# EAGLE design like-a-g35 (EAGLE 6.2)
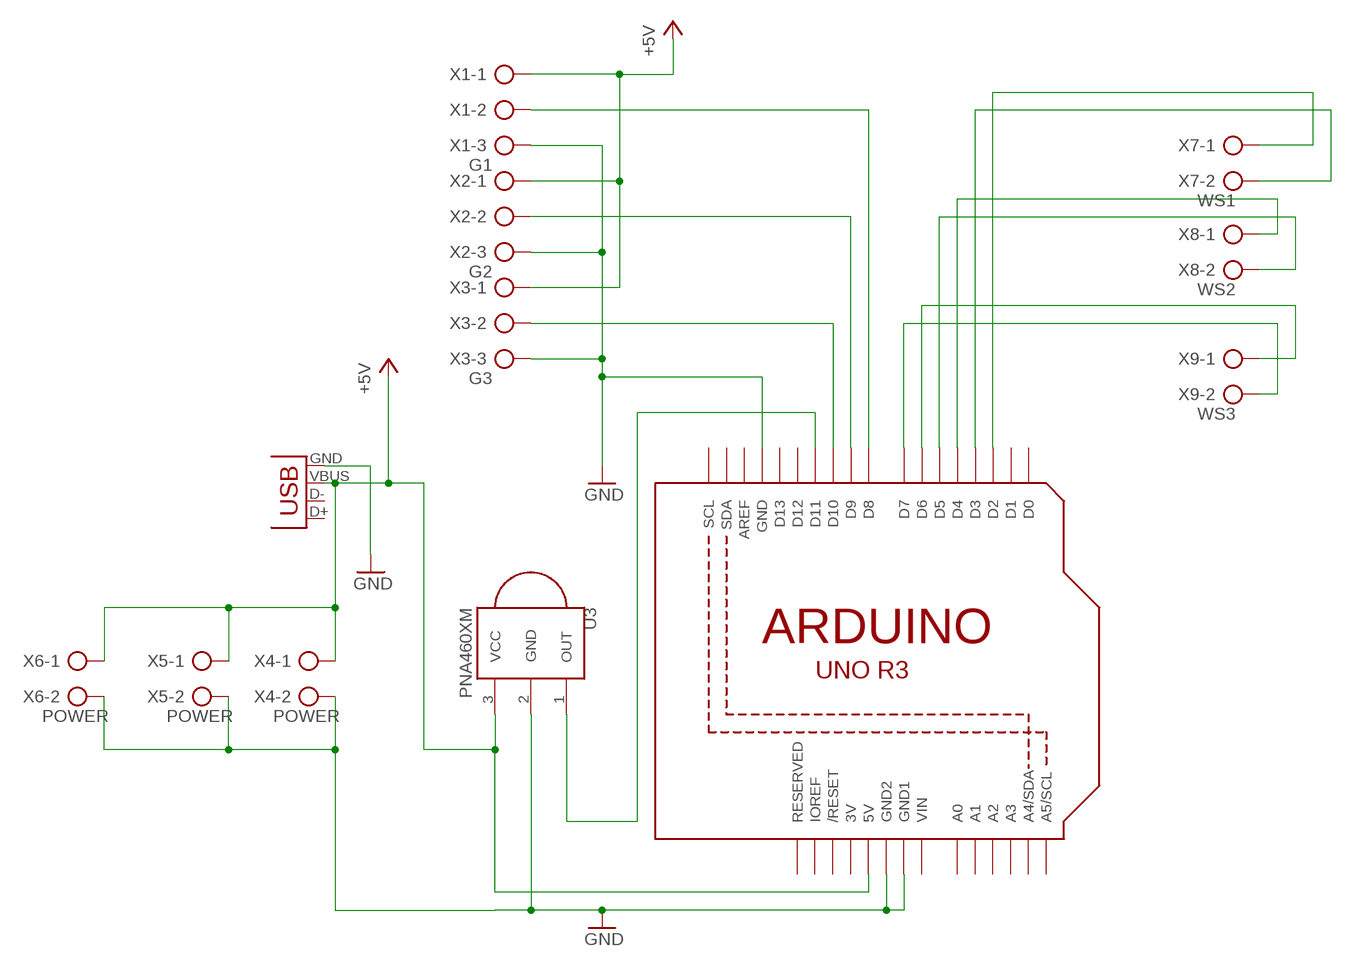
[diagram p0: schematic, sheet 1]

## Parts
U1  ARDUINOR3-DIMENSION  [ARDUINOR3]
U2  FCI_8193_MICRO_USB  [FCI_MICRO_USB_8193]
U3  PNA460XM  [PNA460XM]
X1  G1  AK300/3  [AK300/3]
X2  G2  AK300/3  [AK300/3]
X3  G3  AK300/3  [AK300/3]
X4  POWER  AK300/2  [AK300/2]
X5  POWER  AK300/2  [AK300/2]
X6  POWER  AK300/2  [AK300/2]
X7  WS1  AK300/2  [AK300/2]
X8  WS2  AK300/2  [AK300/2]
X9  WS3  AK300/2  [AK300/2]

## Nets
+5V: U1.5V U2.VBUS U3.3(VCC) X1.1 X2.1 X3.1 X4.1 X5.1 X6.1
CLK1: U1.D3 X7.2
CLK2: U1.D5 X8.2
CLK3: U1.D7 X9.2
DATA1: U1.D2 X7.1
DATA2: U1.D4 X8.1
DATA3: U1.D6 X9.1
GDATA1: U1.D8 X1.2
GDATA2: U1.D9 X2.2
GDATA3: U1.D10 X3.2
GND: U1.GND U1.GND1 U1.GND2 U2.GND U3.2(GND) X1.3 X2.3 X3.3 X4.2 X5.2 X6.2
IR-OUT: U1.D11 U3.1(OUT)
Unconnected: U1.A0 U1.A1 U1.A2 U1.A3 U1.A4(A4/SDA) U1.A5(A5/SCL) U1.AREF U1.D0 U1.D1 U1.D12 U1.D13 U1.IOREF U1.RESERVED U1.RESET(/RESET) U1.SCL U1.SDA U2.D+ U2.D-

## Power pins joined to a net without a drawn wire
3V: U1.3V
VIN: U1.VIN

## Library data of the parts
U1 = adafruit:ARDUINOR3: This is a new object for the new Arduino R3 - with extra pins that you may want to use (such as IOref, and duplicated A4/A5
U2 = programmer:FCI_8193_MICRO_USB
U3 = adafruit:PNA460XM: IR 38KHz receiver PNA4602 and related receivers http://www.ladyada.net/library/pcb/eaglelibrary.html
X1-X3 = like-a-g35:AK300/3: CONNECTOR; OC_FARNELL: unknown; OC_NEWARK: unknown
X4-X9 = con-ptr500:AK300/2: CONNECTOR; OC_FARNELL: unknown; OC_NEWARK: unknown

## Board
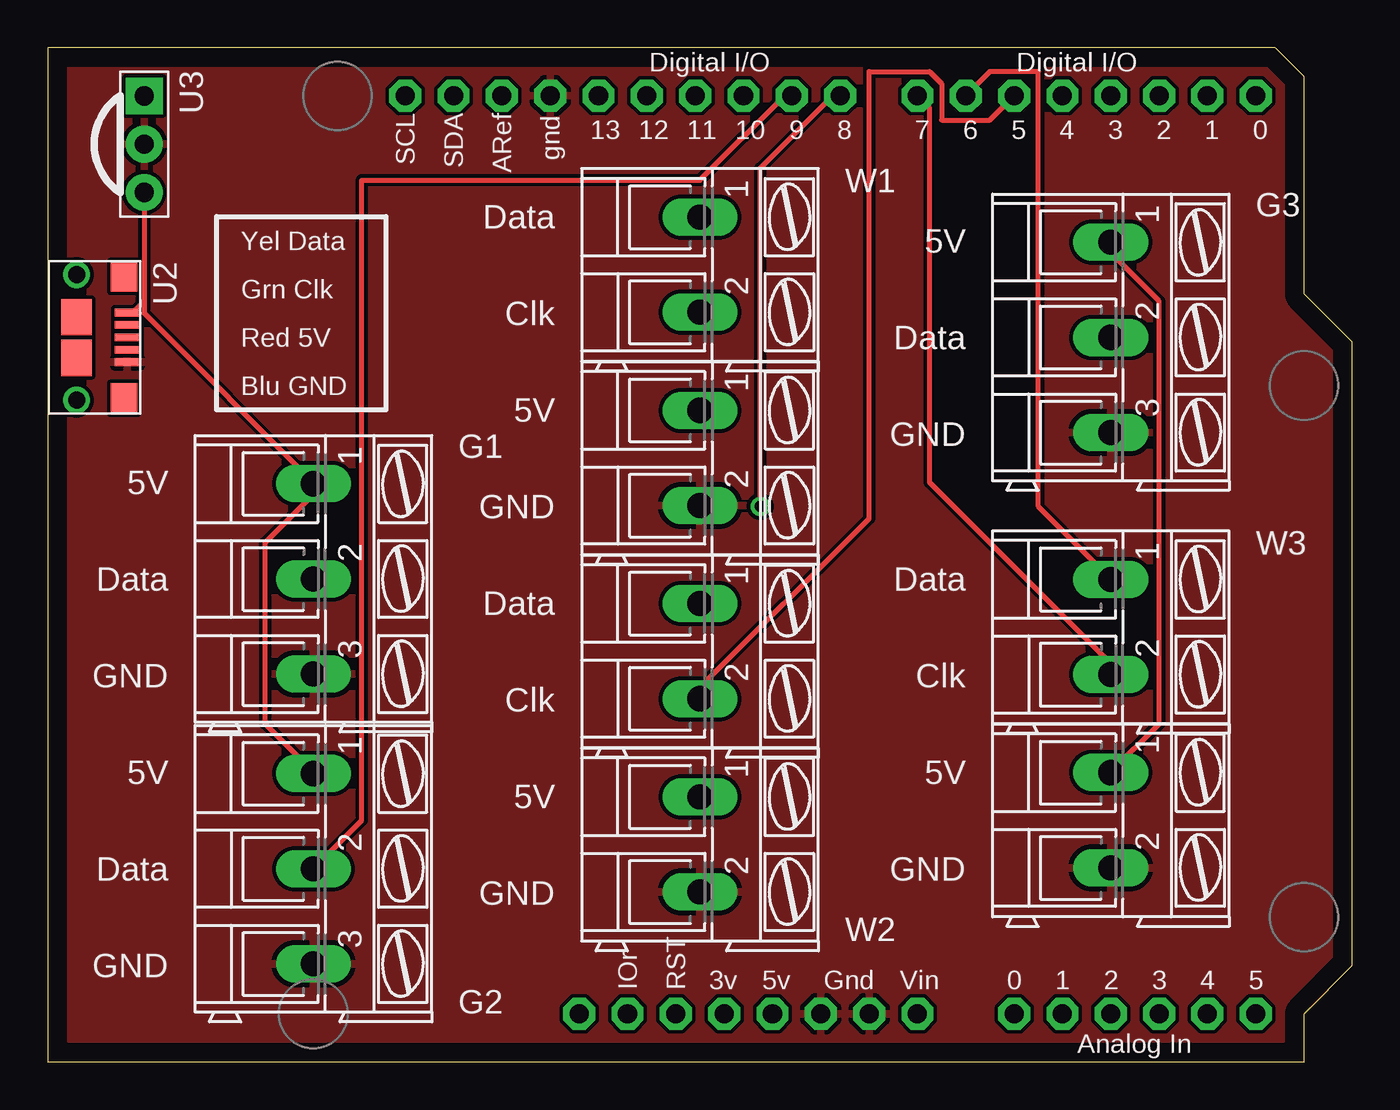
[diagram p1: board, top side]
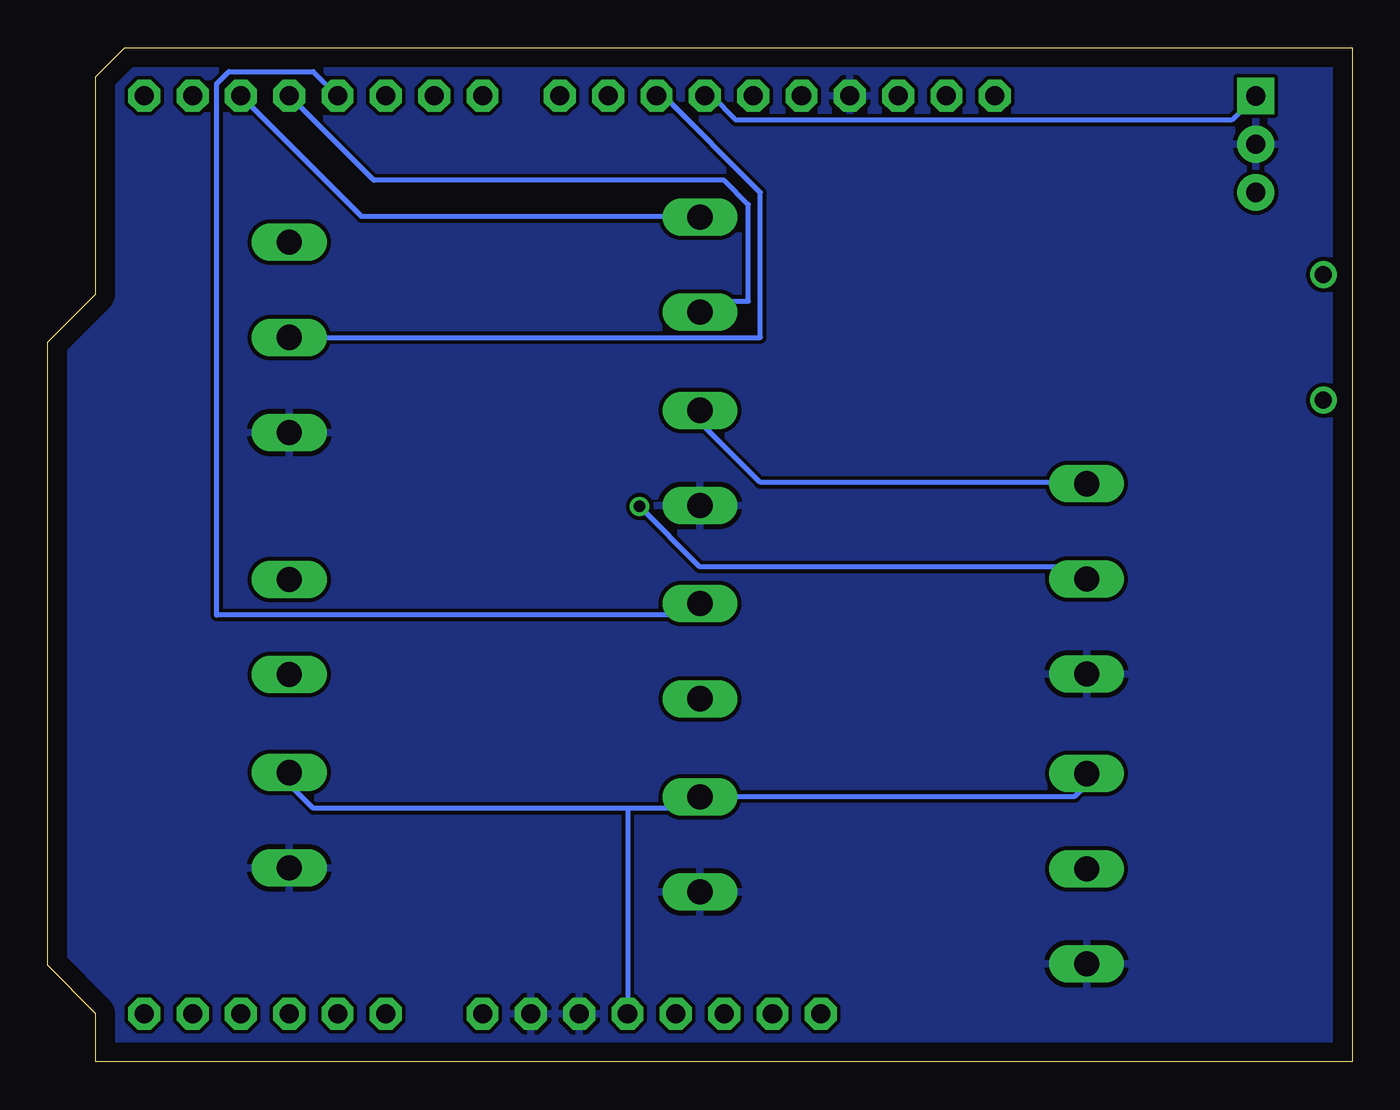
[diagram p2: board, bottom side, seen from below]

Size 68.58 x 53.34 mm. Coordinates in mm from the lower left corner, seen from the top.
Copper layers (1*16): Top 0.035mm / dielectric 1.5mm / Bottom 0.035mm
Design rules: minimum track width 10mil, minimum drill 24mil, track to track 8mil, track to pad 8mil, pad to pad 8mil, via to via 8mil, smd to smd 8mil, copper to edge 40mil, drill to drill 8mil, minimum pad ring 10mil, minimum via ring 8mil, stop-mask expansion 4mil, vias tented up to drill 0mil, thermal gap 10mil

### Footprints (pad centres in the part's own frame; a part is rotated, then mirrored left to right if it is on the bottom)
ARDUINOR3 = drill 1 pad 1.676 octagon: 3V 35.56,2.54; 5V 38.1,2.54; A0 50.8,2.54; A1 53.34,2.54; A2 55.88,2.54; A3 58.42,2.54; A4 60.96,2.54; A5 63.5,2.54; AREF 23.876,50.8; D0 63.5,50.8; D1 60.96,50.8; D2 58.42,50.8; D3 55.88,50.8; D4 53.34,50.8; D5 50.8,50.8; D6 48.26,50.8; D7 45.72,50.8; D8 41.656,50.8; D9 39.116,50.8; D10 36.576,50.8; D11 34.036,50.8; D12 31.496,50.8; D13 28.956,50.8; GND 26.416,50.8; GND1 43.18,2.54; GND2 40.64,2.54; IOREF 30.48,2.54; RESERVED 27.94,2.54; RESET 33.02,2.54; SCL 18.796,50.8; SDA 21.336,50.8; VIN 45.72,2.54
FCI_MICRO_USB_8193 = smd 0.4 x 1.35: D+ 0,2.675; D- -0.65,2.675; GND 1.3,2.675; ID 0.65,2.675; VBUS -1.3,2.675 | smd 1.6 x 1.4: MNT1 -3.2,2.5; MNT2 3.2,2.5 | smd 1.9 x 1.6: MNT3 -1.075,0; MNT4 1.075,0 | drill 0.9: P$1 -3.3,0; P$2 3.3,0
PNA460XM = drill 1.016 pad 1.93 square: 1 -2.54,0 | drill 1.016 pad 1.93: 2 0,0; 3 2.54,0
AK300/3 = drill 1.321 long: 1 -5.004,0; 2 0,0; 3 5.004,0
AK300/2 = drill 1.321 long: 1 -2.515,0; 2 2.489,0

### Placement (x,y rotation side)
U1  0,0 0 top
U2  1.52,38.1 270 top
U3  5.08,48.26 270 top
X1  13.97,25.4 270 top
X2  13.97,10.16 270 top
X3  55.88,38.1 270 top
X4  34.29,31.75 270 top
X5  34.29,11.43 270 top
X6  55.88,12.7 270 top
X7  34.29,41.91 270 top
X8  34.29,21.59 270 top
X9  55.88,22.86 270 top

### Tracks (layer width: path | path; a pad name or v marks a point on that pad's centre or on a via)
+5V
  Top 0.254: 5.08,40.01 4.45,39.37 U2.VBUS | U3.3 5.08,40.01 | 5.08,40.01 5.08,39.37 13.97,30.48 X1.1 13.97,29.84 11.43,27.3 11.43,17.78 13.97,15.24 X2.1 | X3.1 55.88,42.55 58.42,40.01 58.42,17.78 55.88,15.24 X6.1
  Bottom 0.254: X4.1 34.29,33.66 31.11,30.48 13.97,30.48 X1.1 | 38.1,13.34 U1.5V | 38.1,13.34 34.29,13.34 X5.1 34.29,13.97 14.61,13.97 13.97,14.61 X2.1 | 38.1,13.34 54.61,13.34 55.88,14.61 X6.1
CLK1
  Bottom 0.254: U1.D3 51.44,46.35 33.02,46.35 31.75,45.09 31.75,40.01 34.29,40.01 X7.2
CLK2
  Top 0.254: U1.D5 49.53,49.53 46.99,49.53 46.99,51.44 46.35,52.07 43.18,52.07 43.18,28.57 34.29,19.68 X8.2
CLK3
  Top 0.254: U1.D7 46.35,50.16 46.35,30.48 55.88,20.95 X9.2
DATA1
  Bottom 0.254: U1.D2 52.07,44.45 34.29,44.45 X7.1
DATA2
  Bottom 0.254: U1.D4 54.61,52.07 59.05,52.07 59.69,51.44 59.69,23.5 34.29,23.5 X8.1
DATA3
  Top 0.254: U1.D6 49.53,52.07 52.07,52.07 52.07,29.21 55.88,25.4 X9.1
GDATA1  (via drill 0.61)
  Top 0.254: v37.47,29.21 37.47,46.99 41.27,50.8 U1.D8
  Bottom 0.254: v37.47,29.21 34.29,26.04 14.61,26.04 X1.2
GDATA2
  Top 0.254: X2.2 16.51,12.7 16.51,46.35 34.29,46.35 38.73,50.8 U1.D9
GDATA3
  Bottom 0.254: X3.2 31.11,38.1 31.11,45.72 36.2,50.8 U1.D10
GND
  pour Top: -2.54,54.61 71.12,54.61 71.12,-1.27 -2.54,-1.27
  pour Bottom: -3.81,55.88 72.39,55.88 72.39,-2.54 -3.81,-2.54
IR-OUT
  Bottom 0.254: U3.1 6.35,49.53 32.38,49.53 33.66,50.8 U1.D11

### Text on the board
tPlace: W1 | Data | G3 | Yel Data | 5V | Grn Clk | Clk | Red 5V | Data | Blu GND | 5V | GND | G1 | 5V | GND | W3 | Data | Data | Data | GND | Clk | Clk | 5V | 5V | 5V | Data | GND | GND | W2 | GND | G2